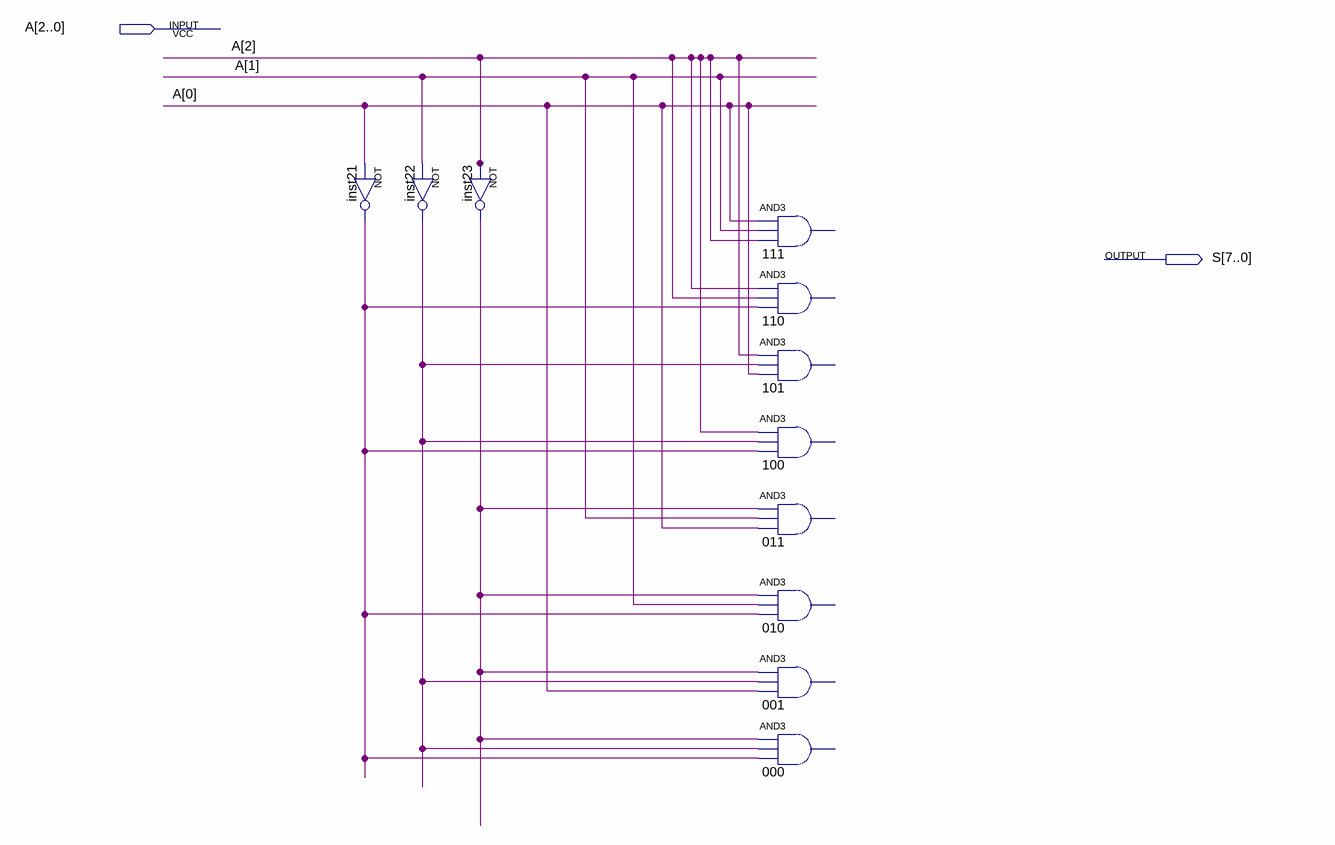
[diagram p0: schematic sheet]
// Quartus schematic decoder.bdf as structural Verilog: 11 symbols, 2 pins
module decoder (
  input  [2:0] A,
  output [7:0] S
);

  wire inst21_out, inst22_out, inst23_out;

  not inst21 (inst21_out, A[0]);
  not inst22 (inst22_out, A[1]);
  not inst23 (inst23_out, A[2]);
  // AND3 111 has open pins: IN1=A[0], IN2=A[1], IN3=A[2], OUT=open
  // AND3 110 has open pins: IN1=A[2], IN2=A[2], IN3=inst21_out, OUT=open
  // AND3 101 has open pins: IN1=A[2], IN2=inst22_out, IN3=A[0], OUT=open
  // AND3 100 has open pins: IN1=A[2], IN2=inst22_out, IN3=inst21_out, OUT=open
  // AND3 011 has open pins: IN1=inst23_out, IN2=A[1], IN3=A[0], OUT=open
  // AND3 010 has open pins: IN1=inst23_out, IN2=A[1], IN3=inst21_out, OUT=open
  // AND3 001 has open pins: IN1=inst23_out, IN2=inst22_out, IN3=A[0], OUT=open
  // AND3 000 has open pins: IN1=inst23_out, IN2=inst22_out, IN3=inst21_out, OUT=open
endmodule
